# EAGLE design IR_LED (EAGLE 9.6.2)
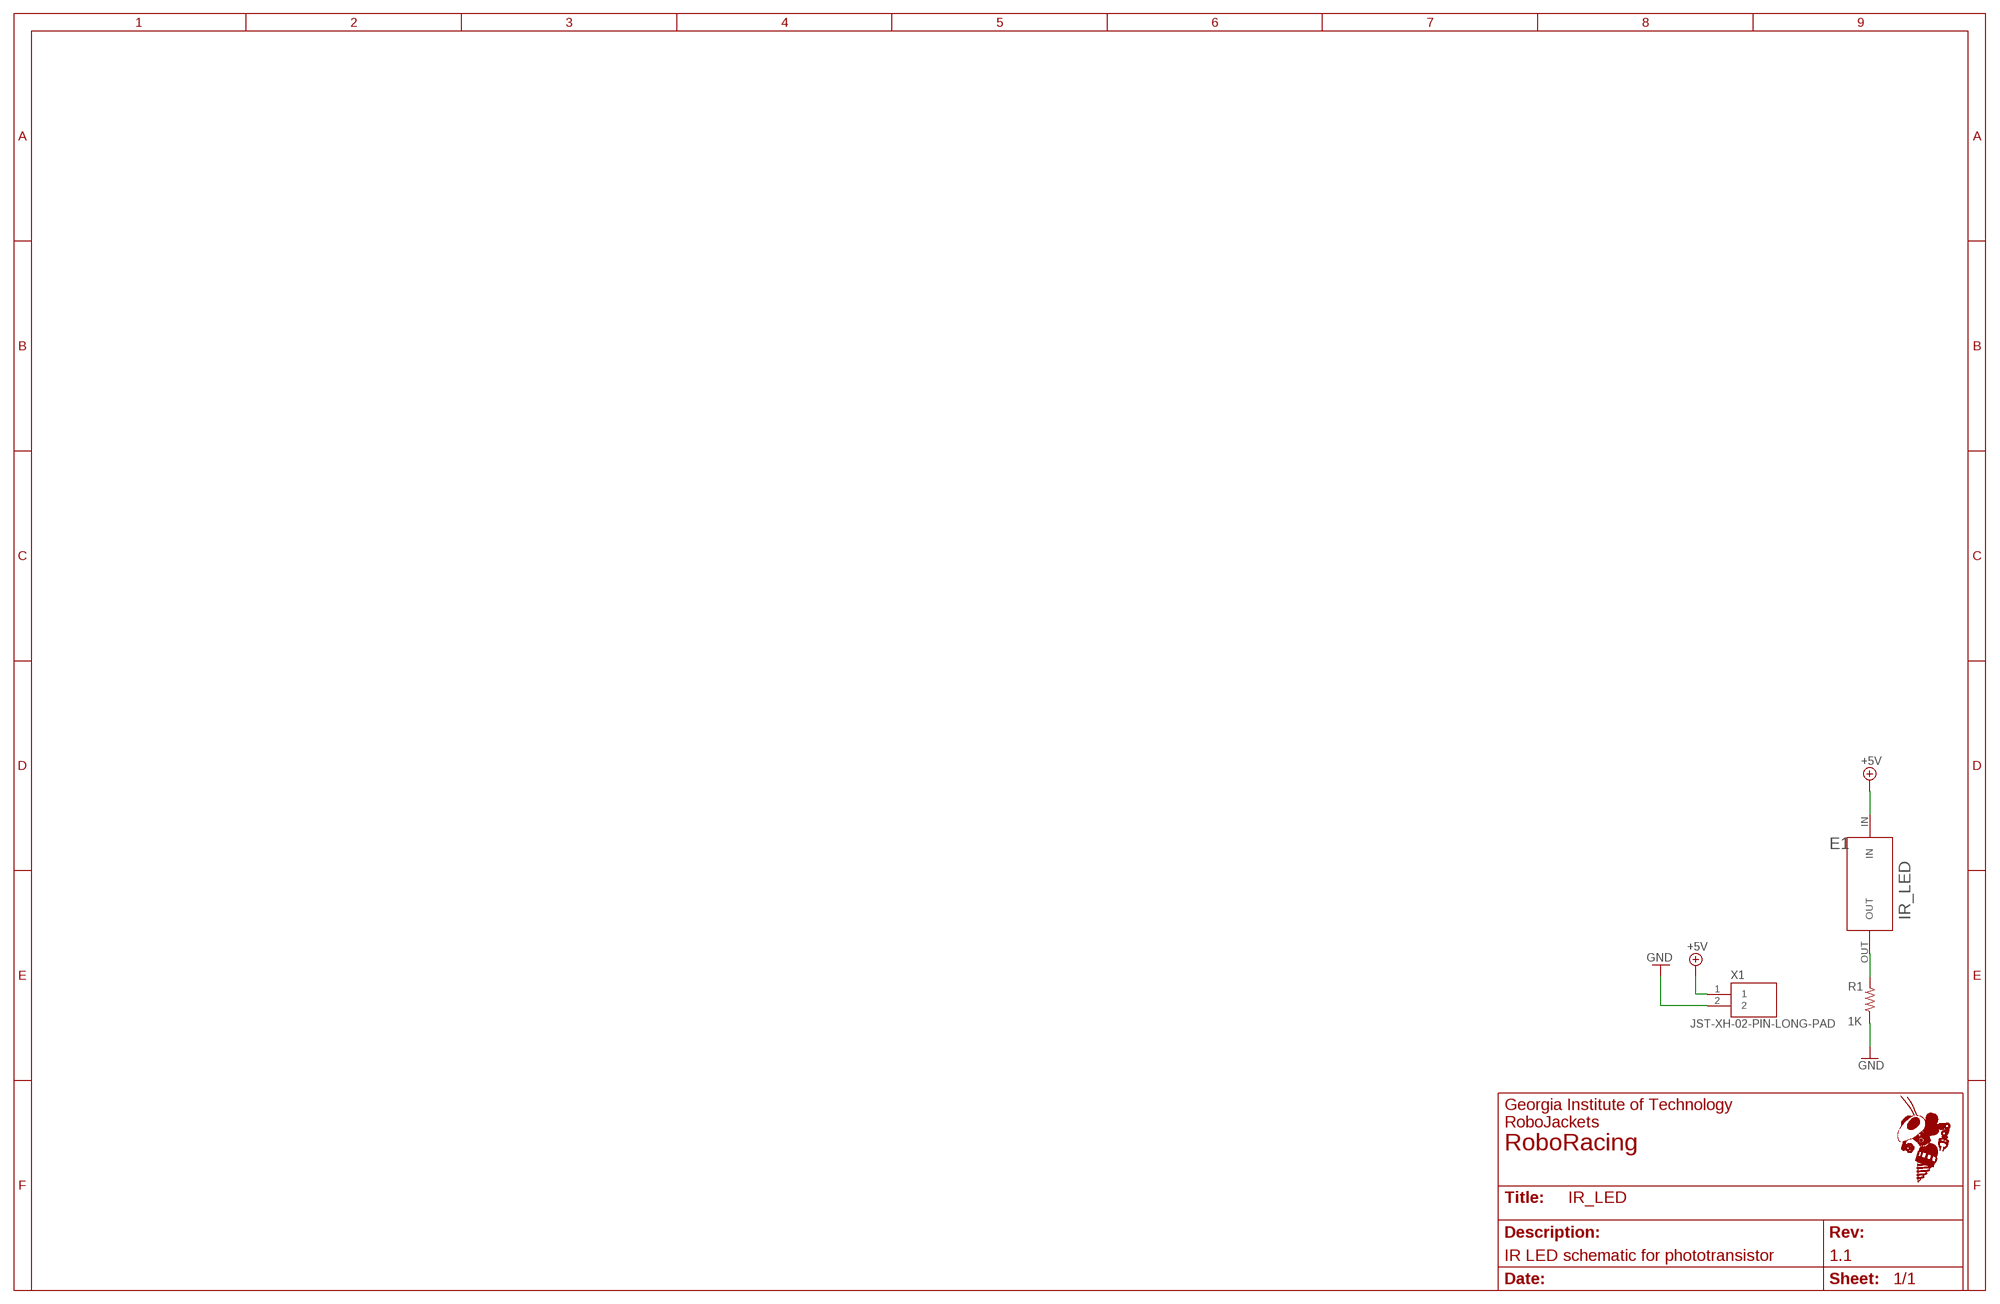
[diagram p0: schematic, sheet 1]
FRAME1 (FRAME_11_17): REVISION: 1.1; SCH_DESC: IR LED schematic for phototransistor; TEAM: RoboRacing

## Parts
E1  IR_LED  [STD_FP]
R1  1K  R-US_R0603  [R0603]
X1  JST-XH-02-PIN-LONG-PAD  [JST-XH-02-PACKAGE-LONG-PAD]

## Nets
+5V: E1.IN X1.1
GND: R1.1 X1.2
N$1: E1.OUT R1.2

## Library data of the parts
E1 = SpeedometerParts:IR_LED: Abstract IR LED, for use in speedometer
R1 = rcl:R-US_: RESISTOR, American symbol; SPICEPREFIX: R
X1 = RoboJackets-Connectors:JST-XH-02-PIN: JST XH Connector 2 Pin Wire to board connector. Pitch: 2,54 mm, (0.100") Number of pins: 2 Created by Rembrandt Electronics www.rembrandtelectronics.com

## Board
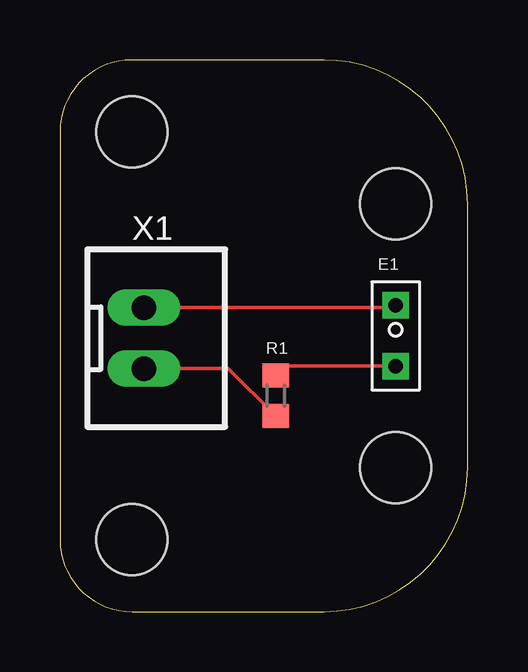
[diagram p1: board, top side]

Size 17 x 23 mm. Coordinates in mm from the lower left corner, seen from the top.
Outline: 3,0 11,0 arc90 17,6 17,17 arc90 11,23 3,23 arc90 0,20 0,3 arc90 3,0
Copper layers (1*16): Top 0.035mm / dielectric 1.5mm / Bottom 0.035mm
Design rules "default": minimum track width 6mil, minimum drill 0.35mm, track to track 6mil, track to pad 6mil, pad to pad 6mil, via to via 6mil, smd to smd 6mil, copper to edge 40mil, drill to drill 6mil, minimum pad ring 10mil, minimum via ring 8mil, stop-mask expansion 4mil, vias tented up to drill 0mil, thermal gap 10mil
Holes 2.95 mm at 3,3 3,20 14,6 14,17

### Footprints (pad centres in the part's own frame; a part is rotated, then mirrored left to right if it is on the bottom)
STD_FP = drill 0.6 square: IN -1.27,0; OUT 1.27,0
R0603 = smd 1 x 1.1: 1 -0.85,0; 2 0.85,0
JST-XH-02-PACKAGE-LONG-PAD = drill 1.016 long: 1 -1.17,-0.5; 2 1.37,-0.5

### Placement (x,y rotation side)
E1  14,11.5 270 top
R1  9,9 90 top
X1  4,11.5 270 top

### Tracks (layer width: path | path; a pad name or v marks a point on that pad's centre or on a via)
+5V
  Top 0.152: X1.1 13.9,12.67 E1.IN
GND
  Top 0.152: X1.2 7.02,10.13 R1.1
N$1
  Top 0.152: 9.15,10 R1.2 9.38,10.23 E1.OUT